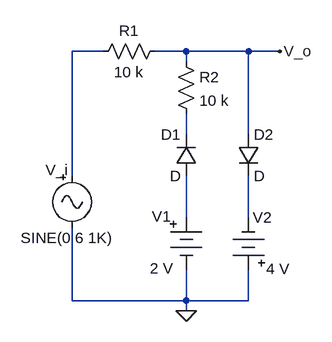
[diagram p0: schematic fig2.asc]
fig2.asc, the LTspice schematic file:
Version 4
SHEET 1 880 680
WIRE 16 64 -32 64
WIRE 144 64 96 64
WIRE 240 64 144 64
WIRE 288 64 240 64
WIRE 144 80 144 64
WIRE 144 192 144 160
WIRE 240 192 240 64
WIRE -32 256 -32 64
WIRE 144 320 144 256
WIRE 240 320 240 256
WIRE -32 448 -32 336
WIRE 144 448 144 400
WIRE 144 448 -32 448
WIRE 240 448 240 400
WIRE 240 448 144 448
WIRE 144 464 144 448
FLAG 144 464 0
FLAG 288 64 V_o
SYMBOL res 112 48 R90
WINDOW 0 0 56 VBottom 2
WINDOW 3 32 56 VTop 2
SYMATTR InstName R1
SYMATTR Value 10 k
SYMBOL diode 224 192 R0
SYMATTR InstName D2
SYMBOL diode 160 256 R180
WINDOW 0 24 64 Left 2
WINDOW 3 24 0 Left 2
SYMATTR InstName D1
SYMBOL Misc\\battery 144 304 R0
WINDOW 0 -53 14 Left 2
WINDOW 3 -56 94 Left 2
SYMATTR InstName V1
SYMATTR Value 2 V
SYMBOL Misc\\battery 240 416 R180
WINDOW 0 -36 96 Left 2
WINDOW 3 -63 17 Left 2
SYMATTR InstName V2
SYMATTR Value 4 V
SYMBOL Misc\\signal -32 240 R0
WINDOW 0 -41 7 Left 2
WINDOW 3 -79 111 Left 2
SYMATTR InstName V_i
SYMATTR Value SINE(0 6 1K)
SYMBOL res 128 64 R0
SYMATTR InstName R2
SYMATTR Value 10 k

The netlist it stands for:
* fig2.asc
R1 V_o N001 10 k
D2 V_o N004 D
D1 N003 N002 D
V1 N003 0 2 V
V2 0 N004 4 V
V_i N001 0 SINE(0 6 1K)
R2 V_o N002 10 k
.model D D
.lib standard.dio
.backanno
.end